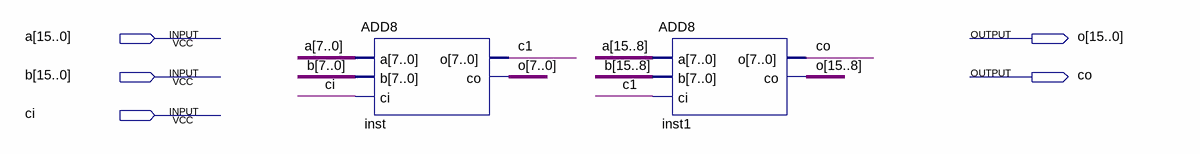
[diagram p0: schematic sheet]
// Quartus schematic ADD16.bdf as structural Verilog: 2 symbols, 5 pins
module ADD16 (
  input  [15:0] a,
  input  [15:0] b,
  input  ci,
  output [15:0] o,
  output co
);

  wire c1;

  ADD8 inst (.a(a[7:0]), .b(b[7:0]), .ci(ci), .o(c1), .co(o[7:0]));
  ADD8 inst1 (.a(a[15:8]), .b(b[15:8]), .ci(c1), .o(co), .co(o[15:8]));
endmodule
